# EAGLE schematic board (EAGLE 6.5.0)
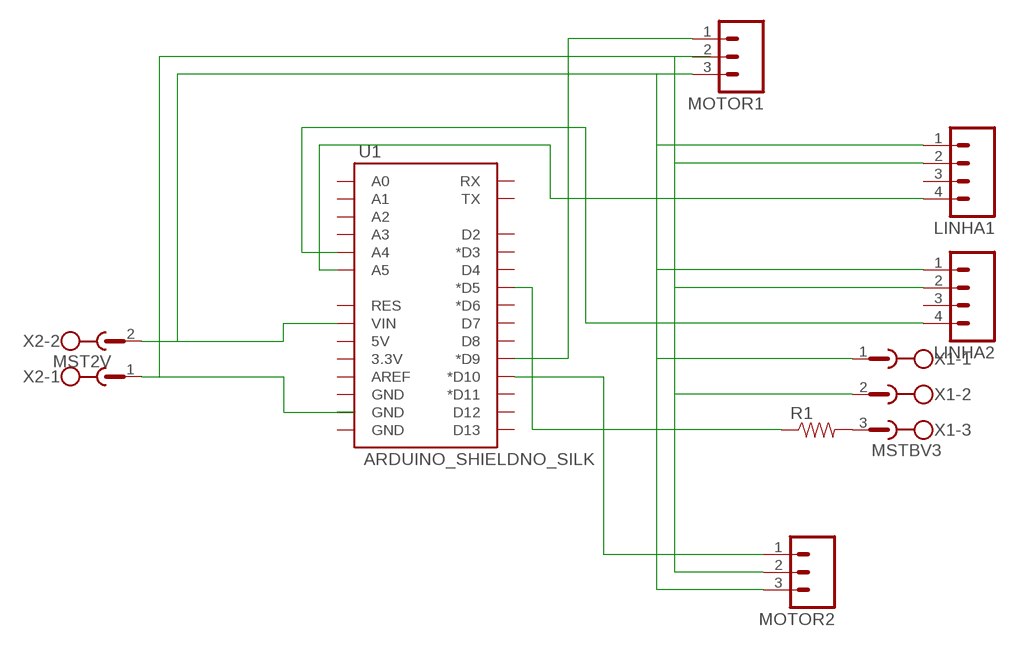
[diagram p0: schematic, sheet 1]

## Parts
LINHA1  M04LONGPADS  [1X04_LONGPADS]
LINHA2  M04LONGPADS  [1X04_LONGPADS]
MOTOR1  M03LONGPADS  [1X03_LONGPADS]
MOTOR2  M03LONGPADS  [1X03_LONGPADS]
R1  10KOHM-1/6W-5%(PTH)KIT  [AXIAL-0.3-KIT]
U1  ARDUINO_SHIELDNO_SILK  [DUEMILANOVE_VIAS]
X1  MSTBV3  [MSTBV3]
X2  MST2V  [MSTBV2]

## Nets
N$1: LINHA1.1 LINHA2.1 MOTOR1.3 MOTOR2.3 U1.VIN X1.1 X2.2
N$3: MOTOR1.1 U1.D9(*D9)
N$4: MOTOR2.1 U1.D10(*D10)
N$6: LINHA1.2 LINHA2.2 MOTOR2.2 U1.GND@1(GND) X1.2 X2.1
N$7: LINHA1.4 U1.A5
N$8: LINHA2.4 U1.A4
N$9: R1.P$2 X1.3
N$10: R1.P$1 U1.D5(*D5)
Unconnected: LINHA1.3 LINHA2.3 MOTOR1.2 U1.3.3V U1.5V U1.A0 U1.A1 U1.A2 U1.A3 U1.AREF U1.D2 U1.D3(*D3) U1.D4 U1.D6(*D6) U1.D7 U1.D8 U1.D11(*D11) U1.D12 U1.D13 U1.GND@0(GND) U1.GND@2(GND) U1.RES U1.RX U1.TX

## Library data of the parts
LINHA1 LINHA2 = SparkFun-Connectors:M04: Header 4 Standard 4-pin 0.1" header. Use with straight break away headers (SKU : PRT-00116), right angle break away headers (PRT-00553), swiss pins (PRT-00743), machine pins (PRT-00117), and female headers (PRT-00115). Molex polarized connector foot print use with SKU : PRT-08231 with associated crimp pins and housings. 1MM SMD Version SKU: PRT-10208; PROD_ID: CONN-09696
MOTOR1 MOTOR2 = SparkFun-Connectors:M03: Header 3 Standard 3-pin 0.1" header. Use with straight break away headers (SKU : PRT-00116), right angle break away headers (PRT-00553), swiss pins (PRT-00743), machine pins (PRT-00117), and female headers (PRT-00115). Molex polarized connector foot print use with SKU : PRT-08232 with associated crimp pins and housings.
R1 = SparkFun-Resistors:10KOHM-1/6W-5%(PTH): RES-08375; PROD_ID: RES-08375
U1 = SparkFun-Boards:ARDUINO_SHIELD: Arduino shield footprint
X1 = con-phoenix-508:MSTBV3: PHOENIX; MPN: MSTBV 2,5/3-GF-5.08; OC_FARNELL: 1792793; OC_NEWARK: 69R9846
X2 = con-phoenix-508:MST2V: PHOENIX; OC_FARNELL: unknown; OC_NEWARK: unknown